# EAGLE design input2f (EAGLE 7.5.0)
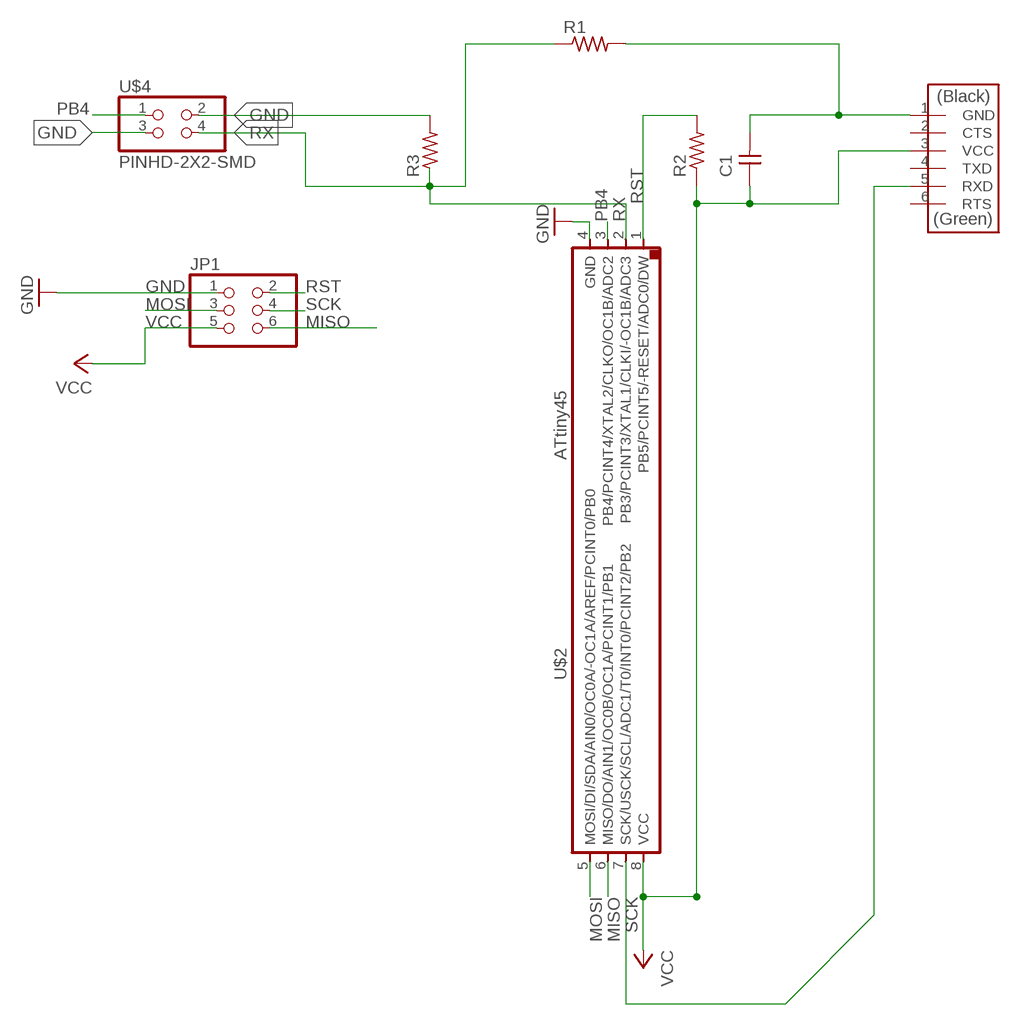
[diagram p0: schematic, sheet 1]

## Parts
C1  CAP-UNPOLARIZEDFAB  [C1206FAB]
JP1  PINHD-2X3-SMD  [2X03SMD]
R1  RES-US1206FAB  [R1206FAB]
R2  RES-US1206FAB  [R1206FAB]
R3  RES-US1206FAB  [R1206FAB]
U$1  FTDI-SMD-HEADER  [1X06SMD]
U$2  ATTINY45SI  [SOIC8]
U$4  PINHD-2X2-SMD  [2X02SMD]

## Nets
GND: JP1.1 R3.2 U$2.4(GND) U$4.2 U$4.3
MISO: JP1.6 U$2.6(MISO/DO/AIN1/OC0B/OC1A/PCINT1/PB1)
MOSI: JP1.3 U$2.5(MOSI/DI/SDA/AIN0/OC0A/-OC1A/AREF/PCINT0/PB0)
N$10: C1.2 R1.2 U$1.1(GND)
PB4: U$2.3(PB4/PCINT4/XTAL2/CLKO/OC1B/ADC2) U$4.1
RST: JP1.2 R2.2 U$2.1(PB5/PCINT5/-RESET/ADC0/DW)
RX: R1.1 R3.1 U$2.2(PB3/PCINT3/XTAL1/CLKI/-OC1B/ADC3) U$4.4
SCK: JP1.4 U$1.5(RXD) U$2.7(SCK/USCK/SCL/ADC1/T0/INT0/PCINT2/PB2)
VCC: C1.1 JP1.5 R2.1 U$1.3(VCC) U$2.8(VCC)
Unconnected: U$1.2(CTS) U$1.4(TXD) U$1.6(RTS)

## Library data of the parts
C1 = fab:CAP-UNPOLARIZED
JP1 = fab:PINHD-2X3-SMD: PIN HEADER
R1-R3 = fab:RES-US: Resistor (US Symbol) Variants with postfix FAB are widened to allow the routing of internal traces
U$1 = fab:FTDI-SMD-HEADER
U$2 = fab:ATTINY45
U$4 = fab:PINHD-2X2-SMD

## Board
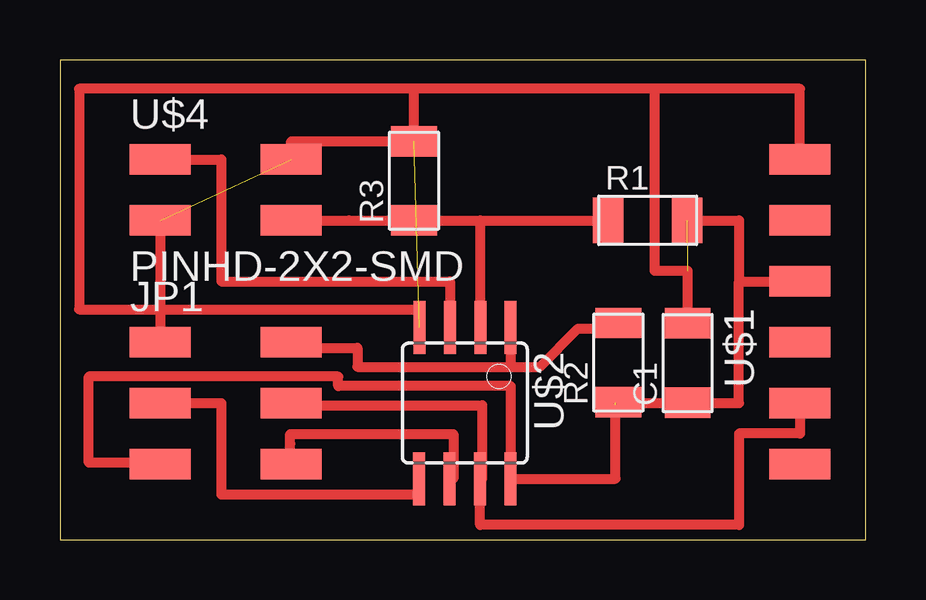
[diagram p1: board, top side]

Size 33.6 x 20 mm. Coordinates in mm from the lower left corner, seen from the top.
Outline: 0,0 33.6,0 33.6,20 0,20 0,0
Copper layers (1*16): Top 0.035mm / dielectric 1.5mm / Bottom 0.035mm
Design rules "default": minimum track width 10mil, minimum drill 24mil, track to track 8mil, track to pad 8mil, pad to pad 8mil, via to via 8mil, smd to smd 8mil, copper to edge 40mil, drill to drill 8mil, minimum pad ring 10mil, minimum via ring 8mil, stop-mask expansion 4mil, vias tented up to drill 0mil, thermal gap 10mil

### Footprints (pad centres in the part's own frame; a part is rotated, then mirrored left to right if it is on the bottom)
C1206FAB = smd 1.27 x 1.905: 1 -1.651,0; 2 1.651,0
2X03SMD = smd 2.54 x 1.27: 1 -2.54,2.54; 2 2.92,2.54; 3 -2.54,0; 4 2.92,0; 5 -2.54,-2.54; 6 2.92,-2.54
R1206FAB = smd 1.27 x 1.905: 1 -1.651,0; 2 1.651,0
1X06SMD = smd 2.54 x 1.27: 1 0,6.35; 2 0,3.81; 3 0,1.27; 4 0,-1.27; 5 0,-3.81; 6 0,-6.35
SOIC8 = smd 0.5 x 2.2: 1 -1.905,-3.154; 2 -0.645,-3.154; 3 0.625,-3.154; 4 1.895,-3.154; 5 1.905,3.154; 6 0.635,3.154; 7 -0.635,3.154; 8 -1.905,3.154
2X02SMD = smd 2.54 x 1.27: 1 -2.54,1.27; 2 2.92,1.27; 3 -2.54,-1.27; 4 2.92,-1.27

### Placement (x,y rotation side)
C1  26.17,7.36 90 top
JP1  6.72,5.69 0 top
R1  24.5,13.31 0 top
R2  23.28,7.38 90 top
R3  14.76,14.96 90 top
U$1  30.85,9.5 0 top
U$2  16.88,5.69 180 top
U$4  6.72,14.58 0 top

### Tracks (layer width: path | path; a pad name or v marks a point on that pad's centre or on a via)
GND  (2 unrouted)
  Top 0.406: U$4.3 JP1.1 | U$4.2 9.64,16.61 R3.2 14.76,18.8 14.8,18.8
MISO
  Top 0.406: JP1.6 9.6,4 9.6,4.4 16.4,4.4 16.4,2.54 U$2.6
MOSI
  Top 0.406: JP1.3 6.72,5.69 6.72,1.88 14.97,1.88 U$2.5
N$10  (1 unrouted)
  Top 0.406: U$1.1 30.85,18.8 24.8,18.8 | 24.8,18.8 0.8,18.8 0.8,9.6 14.8,9.6 | C1.2 26.17,11.2 24.8,11.2 24.8,18.8
PB4
  Top 0.406: U$4.1 6.72,15.85 6.72,10.77 16.25,10.77 U$2.3
RST
  Top 0.406: JP1.2 9.64,8 12.4,8 12.4,7.2 18.79,7.2 | 18.79,7.2 20,7.2 21.6,8.8 23.05,8.8 R2.2 | U$2.1 18.79,7.2
RX
  Top 0.406: U$4.4 12.04,13.31 R3.1 17.52,13.31 | 17.52,13.31 R1.1 | U$2.2 17.52,13.31
SCK
  Top 0.406: U$1.5 30.85,4.42 28.31,4.42 28.31,0.61 17.52,0.61 U$2.7 17.6,2.54 17.6,5.6 9.64,5.6 JP1.4
VCC  (1 unrouted)
  Top 0.406: U$2.8 23.16,2.54 23.16,5.61 R2.1 | 23.16,5.69 25.77,5.69 | 25.77,5.69 C1.1 | 25.77,5.69 28.31,5.69 28.31,10.77 | 25.77,13.31 28.31,13.31 28.31,10.77 | 28.31,10.77 U$1.3 | JP1.5 4.18,3.2 1.2,3.2 1.2,6.8 11.6,6.8 11.6,6.4 18.8,6.4 U$2.8 | U$2.8